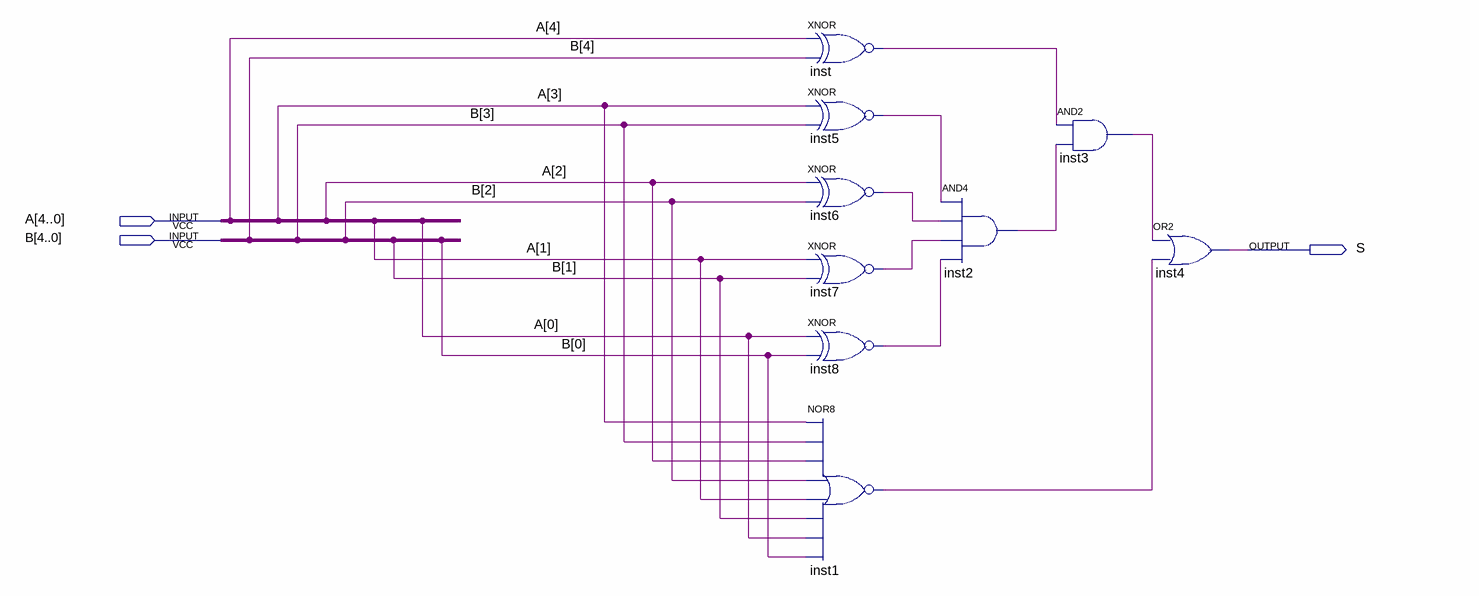
[diagram p0: schematic sheet]
// Quartus schematic ComparadorIgualdade.bdf as structural Verilog: 9 symbols, 3 pins
module ComparadorIgualdade (
  input  [4:0] A,
  input  [4:0] B,
  output S
);

  wire inst1_out, inst2_out, inst3_out, inst5_out, inst6_out, inst7_out, inst8_out, inst_out;

  xnor inst (inst_out, A[4], B[4]);
  xnor inst5 (inst5_out, A[3], B[3]);
  xnor inst6 (inst6_out, A[2], B[2]);
  xnor inst7 (inst7_out, A[1], B[1]);
  xnor inst8 (inst8_out, A[0], B[0]);
  nor inst1 (inst1_out, A[3], B[3], A[2], B[2], A[1], B[1], A[0], B[0]);
  and inst2 (inst2_out, inst5_out, inst6_out, inst7_out, inst8_out);
  and inst3 (inst3_out, inst_out, inst2_out);
  or inst4 (S, inst3_out, inst1_out);
endmodule
